# EAGLE design EuroProtoFront (EAGLE 6.5.0)
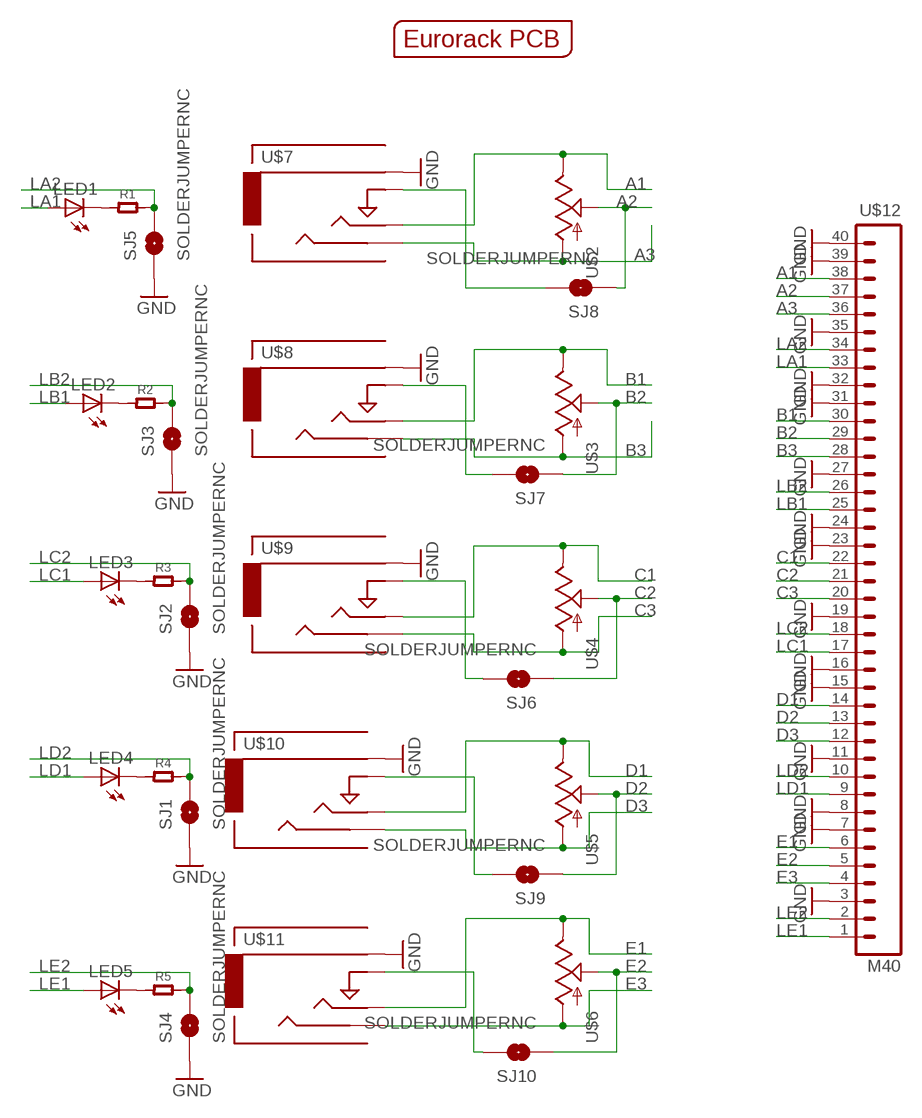
[diagram p0: schematic, sheet 1]

## Parts
LED1  LED3MM  [LED3MM]
LED2  LED3MM  [LED3MM]
LED3  LED3MM  [LED3MM]
LED4  LED3MM  [LED3MM]
LED5  LED3MM  [LED3MM]
R1  R-0603  [R0603]
R2  R-0603  [R0603]
R3  R-0603  [R0603]
R4  R-0603  [R0603]
R5  R-0603  [R0603]
SJ1  SOLDERJUMPERNC  [SJ_2S]
SJ2  SOLDERJUMPERNC  [SJ_2S]
SJ3  SOLDERJUMPERNC  [SJ_2S]
SJ4  SOLDERJUMPERNC  [SJ_2S]
SJ5  SOLDERJUMPERNC  [SJ_2S]
SJ6  SOLDERJUMPERNC  [SJ_2S]
SJ7  SOLDERJUMPERNC  [SJ_2S]
SJ8  SOLDERJUMPERNC  [SJ_2S]
SJ9  SOLDERJUMPERNC  [SJ_2S]
SJ10  SOLDERJUMPERNC  [SJ_2S]
U$1  EURORACK_PCB4HP  [EURORACK4HPPCB]
U$2  POTZEPHPOT  [OG-POTS_ALPS_POT_VERTICAL]
U$3  POTZEPHPOT  [OG-POTS_ALPS_POT_VERTICAL]
U$4  POTZEPHPOT  [OG-POTS_ALPS_POT_VERTICAL]
U$5  POTZEPHPOT  [OG-POTS_ALPS_POT_VERTICAL]
U$6  POTZEPHPOT  [OG-POTS_ALPS_POT_VERTICAL]
U$7  AUDIO-JACKINPUT  [3.5MM-JACK-SWITCH-13MM-INPUT]
U$8  AUDIO-JACKINPUT  [3.5MM-JACK-SWITCH-13MM-INPUT]
U$9  AUDIO-JACKINPUT  [3.5MM-JACK-SWITCH-13MM-INPUT]
U$10  AUDIO-JACKINPUT  [3.5MM-JACK-SWITCH-13MM-INPUT]
U$11  AUDIO-JACKINPUT  [3.5MM-JACK-SWITCH-13MM-INPUT]
U$12  M40  [1X40]

## Nets
A1: U$2.P$1(E) U$7.TIP@1(TIP) U$7.TIP@2(TIP) U$12.38
A2: SJ8.1 U$2.P$2(S) U$12.37
A3: U$2.P$3(A) U$7.SECOND@1(SECOND) U$7.SECOND@2(SECOND) U$12.36
A4: SJ8.2 U$7.SWITCH@1(SWITCH) U$7.SWITCH@2(SWITCH)
B1: U$3.P$1(E) U$8.TIP@1(TIP) U$8.TIP@2(TIP) U$12.30
B2: SJ7.1 U$3.P$2(S) U$12.29
B3: U$3.P$3(A) U$8.SECOND@1(SECOND) U$8.SECOND@2(SECOND) U$12.28
B4: SJ7.2 U$8.SWITCH@1(SWITCH) U$8.SWITCH@2(SWITCH)
C1: U$4.P$1(E) U$9.TIP@1(TIP) U$9.TIP@2(TIP) U$12.22
C2: SJ6.1 U$4.P$2(S) U$12.21
C3: U$4.P$3(A) U$9.SECOND@1(SECOND) U$9.SECOND@2(SECOND) U$12.20
C4: SJ6.2 U$9.SWITCH@1(SWITCH) U$9.SWITCH@2(SWITCH)
D1: U$5.P$1(E) U$10.TIP@1(TIP) U$10.TIP@2(TIP) U$12.14
D2: SJ9.1 U$5.P$2(S) U$12.13
D3: U$5.P$3(A) U$10.SECOND@1(SECOND) U$10.SECOND@2(SECOND) U$12.12
D4: SJ9.2 U$10.SWITCH@1(SWITCH) U$10.SWITCH@2(SWITCH)
E1: U$6.P$1(E) U$11.TIP@1(TIP) U$11.TIP@2(TIP) U$12.6
E2: SJ10.1 U$6.P$2(S) U$12.5
E3: U$6.P$3(A) U$11.SECOND@1(SECOND) U$11.SECOND@2(SECOND) U$12.4
E4: SJ10.2 U$11.SWITCH@1(SWITCH) U$11.SWITCH@2(SWITCH)
GND: SJ1.1 SJ2.1 SJ3.1 SJ4.1 SJ5.1 U$7.RING@1(RING) U$7.RING@2(RING) U$8.RING@1(RING) U$8.RING@2(RING) U$9.RING@1(RING) U$9.RING@2(RING) U$10.RING@1(RING) U$10.RING@2(RING) U$11.RING@1(RING) U$11.RING@2(RING) U$12.3 U$12.7 U$12.8 U$12.11 U$12.15 U$12.16 U$12.19 U$12.23 U$12.24 U$12.27 U$12.31 U$12.32 U$12.35 U$12.39 U$12.40
LA1: LED1.A U$12.33
LA2: R1.2 SJ5.2 U$12.34
LB1: LED2.A U$12.25
LB2: R2.2 SJ3.2 U$12.26
LC1: LED3.A U$12.17
LC2: R3.2 SJ2.2 U$12.18
LD1: LED4.A U$12.9
LD2: R4.2 SJ1.2 U$12.10
LE1: LED5.A U$12.1
LE2: R5.2 SJ4.2 U$12.2
N$6: LED1.K(C) R1.1
N$7: LED2.K(C) R2.1
N$8: LED3.K(C) R3.1
N$9: LED4.K(C) R4.1
N$10: LED5.K(C) R5.1

## Library data of the parts
LED1-LED5 = SparkFun-LED:LED: LEDs Standard schematic elements and footprints for 5mm, 3mm, 1206, and 0603 sized LEDs. 5mm - Spark Fun Electronics SKU : COM-00529 (and others)
R1-R5 = OPL:R*
SJ1-SJ10 = SparkFun-Passives:SOLDERJUMPER: Solder Jumper Standard SMD solder jumper. Used to automate production. Two varients : Normally Open and Normally Closed are the same, but have different paste layers. NC will have a large amount of paste and should jumper during reflow.
U$1 = EurorackModularParts:EURORACK_PCB
U$2-U$6 = EurorackModularParts:POT
U$7-U$11 = EurorackModularParts:AUDIO-JACK: Switching Mono 3.5mm Audio Jack from Erthenvar.
U$12 = SparkFun-Connectors:M40: 1x40 .1" header

## Net classes
0 default: width 0.381 mm

## Board
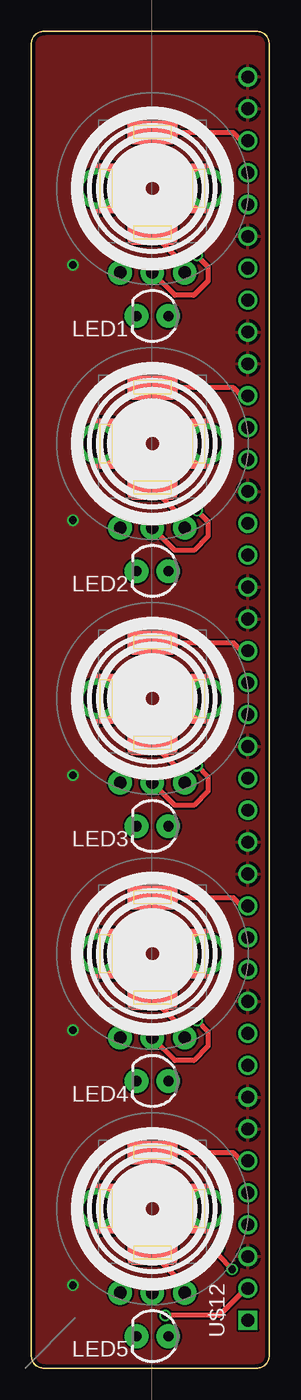
[diagram p1: board, top side]
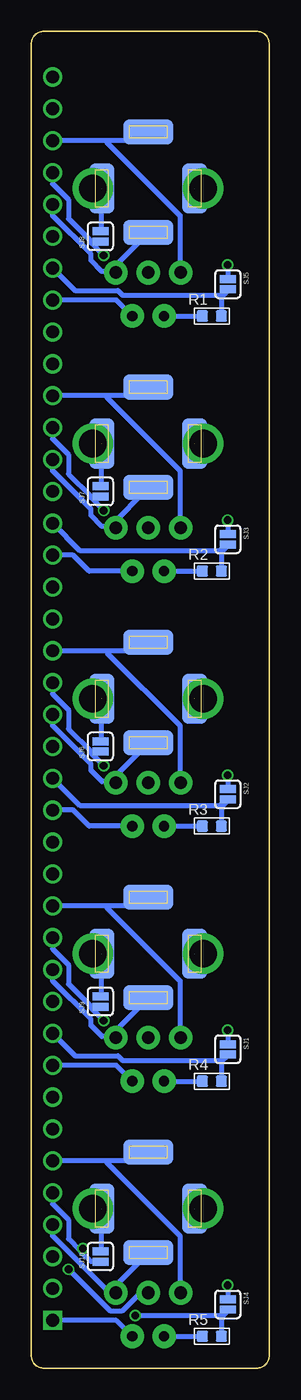
[diagram p2: board, bottom side, seen from below]

Size 18.98 x 106.5 mm. Coordinates in mm from the lower left corner, seen from the top.
Copper layers (1*16): Top 0.035mm / dielectric 1.5mm / Bottom 0.035mm
Design rules "ITEADstudio_DRC": minimum track width 6mil, minimum drill 12mil, track to track 6mil, track to pad 6mil, pad to pad 6mil, via to via 6mil, smd to smd 0mil, copper to edge 10mil, drill to drill 10mil, minimum pad ring 10mil, minimum via ring 6mil, stop-mask expansion 2mil, vias tented up to drill 100mil, thermal gap 10mil

### Footprints (pad centres in the part's own frame; a part is rotated, then mirrored left to right if it is on the bottom)
LED3MM = drill 0.813 pad 1.88: A -1.27,0; K 1.27,0
R0603 = smd 0.889 x 0.889: 1 -0.762,0; 2 0.762,0
SJ_2S = smd 0.635 x 1.27: 1 -0.412,0; 2 0.412,0
OG-POTS_ALPS_POT_VERTICAL = drill 1 pad 1.88: P$1 -2.58,-6.7; P$2 0,-6.7; P$3 2.58,-6.7 | drill 2.2 pad 3.175: P$4 4.4,0; P$5 -4.4,0
3.5MM-JACK-SWITCH-13MM-INPUT = smd 2 x 4: RING@1 -3.7,0; SWITCH@1 3.7,0 | smd 2 x 4 bottom: RING@2 -3.7,0; SWITCH@2 3.7,0 | smd 4 x 2: SECOND@1 0,-3.5; TIP@1 0,4.5 | smd 4 x 2 bottom: SECOND@2 0,-3.5; TIP@2 0,4.5
1X40 = drill 1.016 square: 1 -49.53,0 | drill 1.016: 2 -46.99,0; 3 -44.45,0; 4 -41.91,0; 5 -39.37,0; 6 -36.83,0; 7 -34.29,0; 8 -31.75,0; 9 -29.21,0; 10 -26.67,0; 11 -24.13,0; 12 -21.59,0; 13 -19.05,0; 14 -16.51,0; 15 -13.97,0; 16 -11.43,0; 17 -8.89,0; 18 -6.35,0; 19 -3.81,0; 20 -1.27,0; 21 1.27,0; 22 3.81,0; 23 6.35,0; 24 8.89,0; 25 11.43,0; 26 13.97,0; 27 16.51,0; 28 19.05,0; 29 21.59,0; 30 24.13,0; 31 26.67,0; 32 29.21,0; 33 31.75,0; 34 34.29,0; 35 36.83,0; 36 39.37,0; 37 41.91,0; 38 44.45,0; 39 46.99,0; 40 49.53,0

### Placement (x,y rotation side)
LED1  9.66,83.82 180 top
LED2  9.66,63.5 180 top
LED3  9.66,43.18 180 top
LED4  9.66,22.86 180 top
LED5  9.66,2.54 180 top
R1  4.58,83.82 0 bottom
R2  4.58,63.5 0 bottom
R3  4.58,43.18 0 bottom
R4  4.58,22.86 0 bottom
R5  4.58,2.54 0 bottom
SJ1  3.31,25.4 270 bottom
SJ2  3.31,45.72 270 bottom
SJ3  3.31,66.04 270 bottom
SJ4  3.31,5.08 270 bottom
SJ5  3.31,86.36 270 bottom
SJ6  13.47,49.53 90 bottom
SJ7  13.47,69.85 90 bottom
SJ8  13.47,90.17 90 bottom
SJ9  13.47,29.21 90 bottom
SJ10  13.47,8.89 90 bottom
U$1  -0.5,0 0 top
U$2  9.66,93.98 0 top
U$3  9.66,73.66 0 top
U$4  9.66,53.34 0 top
U$5  9.66,33.02 0 top
U$6  9.66,12.7 0 top
U$7  9.66,93.98 0 top
U$8  9.66,73.66 0 top
U$9  9.66,53.34 0 top
U$10  9.66,33.02 0 top
U$11  9.66,12.7 0 top
U$12  17.28,53.34 90 top

### Tracks (layer width: path | path; a pad name or v marks a point on that pad's centre or on a via)
A1
  Top 0.381: U$12.38 16.77,97.79 16.14,98.42 9.66,98.42 U$7.TIP@1
  Bottom 0.381: 12.96,97.79 10.29,97.79 9.66,98.42 U$7.TIP@1 | 12.96,97.79 U$12.38 | U$2.P$1 7.12,87.38 7.12,91.82 12.96,97.66 12.96,97.79
A2  (via drill 0.61)
  Top 0.381: v13.22,88.65 14.11,87.76 14.11,86.61 12.96,85.47 11.44,85.47 9.66,87.25 U$2.P$2
  Bottom 0.381: 14.23,89.79 13.47,89.79 SJ8.1 | 14.23,89.79 16.01,91.57 16.01,93.09 17.28,94.36 U$12.37 | v13.22,88.65 14.23,89.66 14.23,89.79
A3
  Top 0.381: U$7.SECOND@1 9.66,90.42 12.2,87.88 12.2,87.38 U$2.P$3
  Bottom 0.381: U$12.36 17.28,91.82 14.23,88.77 14.23,88.27 13.34,87.38 12.33,87.38 U$2.P$3 12.58,87.5 9.66,90.42 U$7.SECOND@1
A4  (1 unrouted)
  Bottom 0.381: SJ8.2 13.36,90.58 U$7.SWITCH@2
B1
  Top 0.381: U$12.30 16.77,77.47 16.14,78.11 9.66,78.11 U$8.TIP@1
  Bottom 0.381: 12.96,77.47 10.29,77.47 9.66,78.11 U$8.TIP@1 | 12.96,77.47 U$12.30 | U$3.P$1 7.12,67.06 7.12,71.5 12.96,77.34 12.96,77.47
B2  (via drill 0.61)
  Top 0.381: v13.22,68.33 14.11,67.44 14.11,66.29 12.96,65.15 11.44,65.15 9.66,66.93 U$3.P$2
  Bottom 0.381: 14.23,69.47 13.47,69.47 SJ7.1 | 14.23,69.47 16.01,71.25 16.01,72.77 17.28,74.04 U$12.29 | v13.22,68.33 14.23,69.34 14.23,69.47
B3
  Top 0.381: U$8.SECOND@1 9.66,70.1 12.2,67.56 12.2,67.06 U$3.P$3
  Bottom 0.381: U$12.28 17.28,71.5 14.23,68.45 14.23,67.94 13.34,67.06 12.33,67.06 U$3.P$3 12.58,67.18 9.66,70.1 U$8.SECOND@1
B4  (1 unrouted)
  Bottom 0.381: SJ7.2 13.36,70.26 U$8.SWITCH@2
C1
  Top 0.381: U$12.22 16.77,57.15 16.14,57.78 9.66,57.78 U$9.TIP@1
  Bottom 0.381: 12.96,57.15 10.29,57.15 9.66,57.78 U$9.TIP@1 | 12.96,57.15 U$12.22 | U$4.P$1 7.12,46.74 7.12,51.18 12.96,57.02 12.96,57.15
C2  (via drill 0.61)
  Top 0.381: v13.22,48.01 14.11,47.12 14.11,45.97 12.96,44.83 11.44,44.83 9.66,46.61 U$4.P$2
  Bottom 0.381: 14.23,49.15 13.47,49.15 SJ6.1 | 14.23,49.15 16.01,50.93 16.01,52.45 17.28,53.72 U$12.21 | v13.22,48.01 14.23,49.02 14.23,49.15
C3
  Top 0.381: U$9.SECOND@1 9.66,49.78 12.2,47.24 12.2,46.74 U$4.P$3
  Bottom 0.381: U$12.20 17.28,51.18 14.23,48.13 14.23,47.62 13.34,46.74 12.33,46.74 U$4.P$3 12.58,46.86 9.66,49.78 U$9.SECOND@1
C4  (1 unrouted)
  Bottom 0.381: SJ6.2 13.36,49.94 U$9.SWITCH@2
D1
  Top 0.381: U$12.14 16.77,36.83 16.14,37.47 9.66,37.47 U$10.TIP@1
  Bottom 0.381: 12.96,36.83 10.29,36.83 9.66,37.47 U$10.TIP@1 | 12.96,36.83 U$12.14 | U$5.P$1 7.12,26.42 7.12,30.86 12.96,36.7 12.96,36.83
D2  (via drill 0.61)
  Top 0.381: v13.22,27.69 14.11,26.8 14.11,25.65 12.96,24.51 11.44,24.51 9.66,26.29 U$5.P$2
  Bottom 0.381: 14.23,28.83 13.47,28.83 SJ9.1 | 14.23,28.83 16.01,30.61 16.01,32.13 17.28,33.4 U$12.13 | v13.22,27.69 14.23,28.7 14.23,28.83
D3
  Top 0.381: U$10.SECOND@1 9.66,29.46 12.2,26.92 12.2,26.42 U$5.P$3
  Bottom 0.381: U$12.12 17.28,30.86 14.23,27.81 14.23,27.3 13.34,26.42 12.33,26.42 U$5.P$3 12.58,26.54 9.66,29.46 U$10.SECOND@1
D4  (1 unrouted)
  Bottom 0.381: SJ9.2 13.36,29.62 U$10.SWITCH@2
E1
  Top 0.381: U$12.6 16.77,16.51 16.14,17.14 9.66,17.14 U$11.TIP@1
  Bottom 0.381: 12.96,16.51 10.29,16.51 9.66,17.14 U$11.TIP@1 | 12.96,16.51 U$12.6 | U$6.P$1 7.12,6.1 7.12,10.54 12.96,16.38 12.96,16.51
E2  (via drill 0.61)
  Top 0.381: v16.01,7.87 14.87,9.02 v14.87,9.53
  Bottom 0.381: 15.12,9.4 16.01,10.29 16.01,11.81 17.28,13.08 U$12.5 | 15.12,9.4 14.23,8.51 13.47,8.51 SJ10.1 | v16.01,7.87 12.71,4.57 11.69,4.57 10.29,5.97 9.66,5.97 U$6.P$2 | v14.87,9.53 14.99,9.53 15.12,9.4
E3
  Top 0.381: U$11.SECOND@1 9.66,9.14 12.2,6.6 12.2,6.1 U$6.P$3
  Bottom 0.381: U$12.4 17.28,10.54 12.84,6.1 12.33,6.1 U$6.P$3 12.58,6.22 9.66,9.14 U$11.SECOND@1
E4  (1 unrouted)
  Bottom 0.381: SJ10.2 13.36,9.3 U$11.SWITCH@2
GND  (via drill 0.61)  (5 unrouted)
  Bottom 0.381: v3.31,6.6 SJ4.1 | v3.31,26.92 SJ1.1 | v3.31,47.24 SJ2.1 | v3.31,67.56 SJ3.1 | v3.31,87.88 SJ5.1
  pour Top: -0.5,106.68 19.82,106.68 19.82,0 -0.5,0
LA1
  Bottom 0.381: U$12.33 12.2,85.09 LED1.A
LA2
  Bottom 0.381: 3.82,85.34 R1.2 | 3.82,85.34 3.31,85.85 SJ5.2 | U$12.34 15.5,85.85 12.07,85.85 11.69,85.47 3.95,85.47 3.82,85.34
LB1
  Bottom 0.381: U$12.25 15.63,64.77 14.36,63.5 LED2.A
LB2
  Bottom 0.381: 3.82,65.02 R2.2 | 3.82,65.02 3.31,65.53 SJ3.2 | U$12.26 15.12,65.15 3.95,65.15 3.82,65.02
LC1
  Bottom 0.381: U$12.17 15.63,44.45 14.36,43.18 LED3.A
LC2
  Bottom 0.381: 3.82,44.7 R3.2 | 3.82,44.7 3.31,45.21 SJ2.2 | U$12.18 15.12,44.83 3.95,44.83 3.82,44.7
LD1
  Bottom 0.381: U$12.9 12.2,24.13 LED4.A
LD2
  Bottom 0.381: 3.82,24.38 R4.2 | 3.82,24.38 3.31,24.89 SJ1.2 | U$12.10 15.5,24.89 12.07,24.89 11.69,24.51 3.95,24.51 3.82,24.38
LE1
  Bottom 0.381: U$12.1 12.2,3.81 LED5.A
LE2  (via drill 0.61)
  Top 0.381: v10.68,4.19 14.99,4.19 17.15,6.35 U$12.2
  Bottom 0.381: 3.82,4.06 R5.2 | 3.82,4.06 3.31,4.57 SJ4.2 | v10.68,4.19 3.95,4.19 3.82,4.06
N$6
  Bottom 0.381: LED1.K R1.1
N$7
  Bottom 0.381: LED2.K R2.1
N$8
  Bottom 0.381: LED3.K R3.1
N$9
  Bottom 0.381: LED4.K R4.1
N$10
  Bottom 0.381: LED5.K R5.1